# Altium schematic sheet ASP LEDBoard.SchDoc
size A4
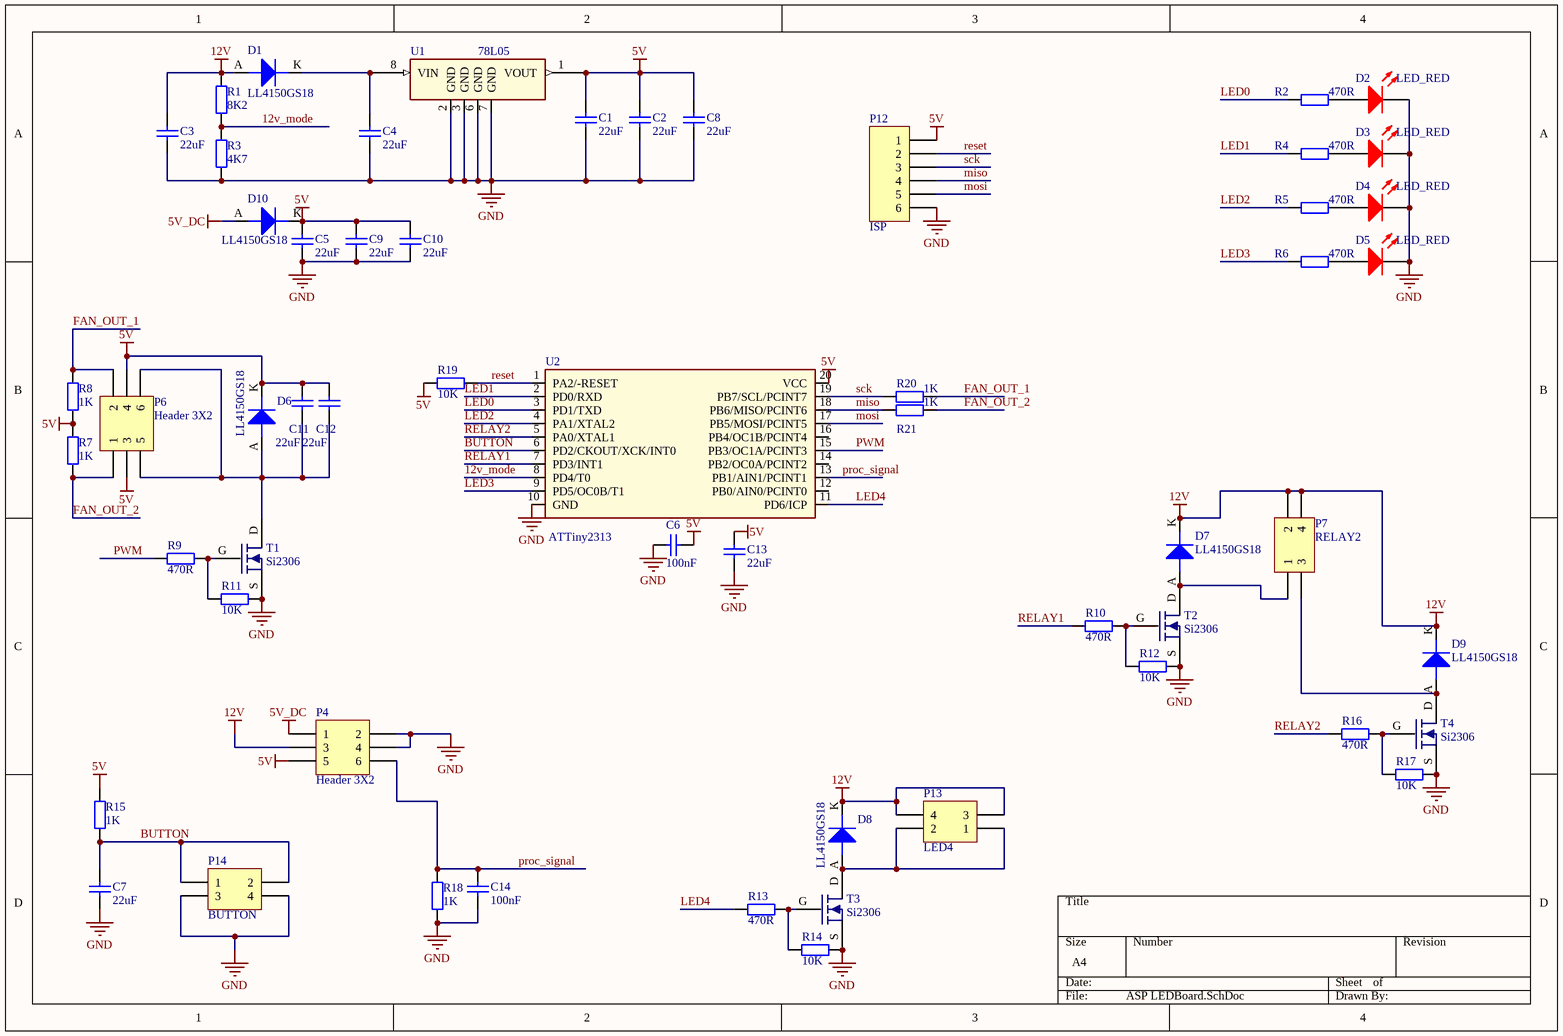
[diagram p0: ASP LEDBoard.SchDoc]

## Parts
C1  22uF  [FP_0805_CAP_085]
C2  22uF  [FP_0805_CAP_085]
C3  22uF  [FP_0805_CAP_085]
C4  22uF  [FP_0805_CAP_085]
C5  22uF  [FP_0805_CAP_085]
C6  100nF  [FP_0805_CAP_085]
C7  22uF  [FP_0805_CAP_085]
C8  22uF  [FP_0805_CAP_085]
C9  22uF  [FP_0805_CAP_085]
C10  22uF  [FP_0805_CAP_085]
C11  22uF  [FP_0805_CAP_085]
C12  22uF  [FP_0805_CAP_085]
C13  22uF  [FP_0805_CAP_085]
C14  100nF  [FP_0805_CAP_085]
D1  LL4150GS18  [SOD-80]
D2  LED_RED  [1206 LED Reversed]
D3  LED_RED  [1206 LED Reversed]
D4  LED_RED  [1206 LED Reversed]
D5  LED_RED  [1206 LED Reversed]
D6  LL4150GS18  [SOD-80]
D7  LL4150GS18  [SOD-80]
D8  LL4150GS18  [SOD-80]
D9  LL4150GS18  [SOD-80]
D10  LL4150GS18  [SOD-80]
P4  Header 3X2  [FP_CONN6_2TUSKE_254MM_smd]
P6  Header 3X2  [FP_CONN6_2TUSKE_254MM_smd]
P7  RELAY2  [FP_CONN4_2TUSKE_254MM_smd]
P12  ISP  [HDR1X6]  (no BOM)
P13  LED4  [FP_CONN4_2TUSKE_254MM_smd]
P14  BUTTON  [FP_CONN4_2TUSKE_254MM_smd]
R1  8K2  [FP_0805_RES]
R2  470R  [FP_0805_RES]
R3  4K7  [FP_0805_RES]
R4  470R  [FP_0805_RES]
R5  470R  [FP_0805_RES]
R6  470R  [FP_0805_RES]
R7  1K  [FP_0805_RES]
R8  1K  [FP_0805_RES]
R9  470R  [FP_0805_RES]
R10  470R  [FP_0805_RES]
R11  10K  [FP_0805_RES]
R12  10K  [FP_0805_RES]
R13  470R  [FP_0805_RES]
R14  10K  [FP_0805_RES]
R15  1K  [FP_0805_RES]
R16  470R  [FP_0805_RES]
R17  10K  [FP_0805_RES]
R18  1K  [FP_0805_RES]
R19  10K  [FP_0805_RES]
R20  1K  [FP_0805_RES]
R21  1K  [FP_0805_RES]
T1  Si2306  [FET_SOT23]
T2  Si2306  [FET_SOT23]
T3  Si2306  [FET_SOT23]
T4  Si2306  [FET_SOT23]
U1  78L05  [Supply_SOIC8]
U2  ATTiny2313  [DIGITAL_SOIC20W]

## Nets
5V: C1.2 C2.2 C5.2 C6.2 C8.2 C9.2 C10.2 C11.2 C12.2 C13.2 D6.K D10.K P4.5 P6.3 P6.4 P12.1 R7.2 R8.1 R15.2 R19.2 U1.1(VOUT) U2.20(VCC)
5V_DC: D10.A P4.1
12V: C3.2 D1.A D7.K D8.K D9.K P4.3 P7.2 P7.4 P13.3 P13.4 R1.2
GND: C1.1 C2.1 C3.1 C4.1 C5.1 C6.1 C7.1 C8.1 C9.1 C10.1 C13.1 C14.1 D2.K D3.K D4.K D5.K P4.2 P4.4 P12.6 P14.3 P14.4 R3.2 R11.1 R12.1 R14.1 R17.1 R18.2 T1.S T2.S T3.S T4.S U1.2(GND) U1.3(GND) U1.6(GND) U1.7(GND) U2.10(GND)
12v_mode: R1.1 R3.1 U2.8(PD4/T0)
BUTTON: C7.2 P14.1 P14.2 R15.1 U2.6(PD2/CKOUT/XCK/INT0)
FAN_OUT_1: P6.2 R8.2 R20.1
FAN_OUT_2: P6.1 R7.1 R21.1
LED0: R2.2 U2.3(PD1/TXD)
LED1: R4.2 U2.2(PD0/RXD)
LED2: R5.2 U2.4(PA1/XTAL2)
LED3: R6.2 U2.9(PD5/OC0B/T1)
LED4: R13.2 U2.11(PD6/ICP)
miso: P12.4 R21.2 U2.18(PB6/MISO/PCINT6)
mosi: P12.5 U2.17(PB5/MOSI/PCINT5)
proc_signal: C14.2 P4.6 R18.1 U2.13(PB1/AIN1/PCINT1)
PWM: R9.2 U2.15(PB3/OC1A/PCINT3)
RELAY1: R10.2 U2.7(PD3/INT1)
RELAY2: R16.2 U2.5(PA0/XTAL1)
reset: P12.2 R19.1 U2.1(PA2/-RESET)
sck: P12.3 R20.2 U2.19(PB7/SCL/PCINT7)
NetC4_2: C4.2 D1.K U1.8(VIN)
NetC11_1: C11.1 C12.1 D6.A P6.5 P6.6 T1.D
NetD2_A: D2.A R2.1
NetD3_A: D3.A R4.1
NetD4_A: D4.A R5.1
NetD5_A: D5.A R6.1
NetD7_A: D7.A P7.1 T2.D
NetD8_A: D8.A P13.1 P13.2 T3.D
NetD9_A: D9.A P7.3 T4.D
NetR9_1: R9.1 R11.2 T1.G
NetR10_1: R10.1 R12.2 T2.G
NetR13_1: R13.1 R14.2 T3.G
NetR16_1: R16.1 R17.2 T4.G

Not connected (* = marked no-connect by the designer): U2 12(PB0/AIN0/PCINT0) 14(PB2/OC0A/PCINT2) 16(PB4/OC1B/PCINT4)

## Library data of the parts
C1-C5 C7-C13 = CAP: Capacitor; Order info: [82-08-19]; Value: 22uF
C6 C14 = CAP: Capacitor; Order info: [82-01-25]; Value: 100nF
D1 D6-D10 = DIODE_big: Order info: [83-00-97]
D2-D5 = LED_R: Typical LED; Order info: ---
P4 P6 = Header 3X2: Header, 3-Pin, Dual row; LatestRevisionDate: 17-Jul-2002; LatestRevisionNote: Re-released for DXP Platform.; Publisher: Altium Limited
P7 P13 P14 = Header 2X2H: Header, 2-Pin, Dual row, Right Angle; LatestRevisionDate: 17-Jul-2002; LatestRevisionNote: Re-released for DXP Platform.; Publisher: Altium Limited
P12 = Header 6: Header, 6-Pin; Order info: ---; LatestRevisionDate: 17-Jul-2002; LatestRevisionNote: Re-released for DXP Platform.; Publisher: Altium Limited
R1 = RES: Resistor; Order info: [80-10-97]; Value: 8K2
R2 R4-R6 R9 R10 R13 R16 = RES: Resistor; Order info: [80-10-82]; Value: 470R
R3 = RES: Resistor; Order info: [80-10-94]; Value: 4K7
R7 R8 R15 R18 R20 R21 = RES: Resistor; Order info: [81-10-87]; Value: 1K
R11 R12 R14 R17 R19 = RES: Resistor; Order info: [80-10-98]; Value: 10K
T1-T4 = NMOS: Order info: [86-01-57]
U1 = 78Lxx_SOIC: Order info: [89-10-96]
U2 = ATTiny2313: Order info: [89-21-91]